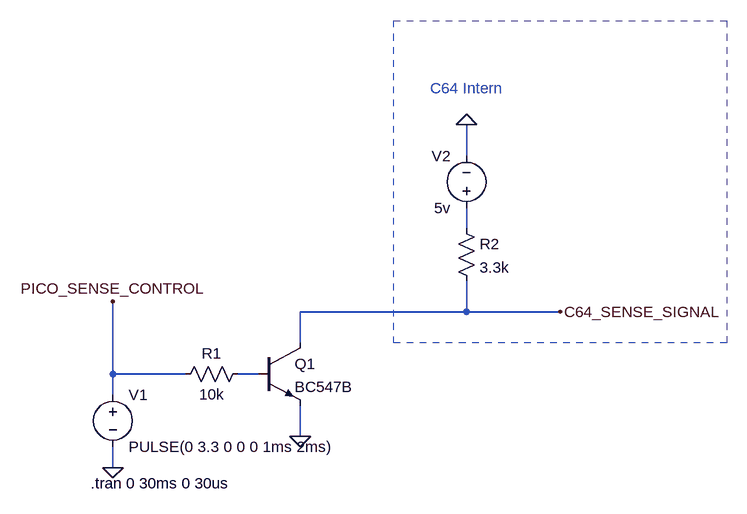
[diagram p0: schematic simulation_sense_signal_control.asc]
simulation_sense_signal_control.asc, the LTspice schematic file:
Version 4
SHEET 1 916 680
WIRE 512 -144 512 -192
WIRE 512 -32 512 -64
WIRE 512 96 512 48
WIRE 512 96 256 96
WIRE 656 96 512 96
WIRE 256 144 256 96
WIRE -32 192 -32 80
WIRE 80 192 -32 192
WIRE 192 192 160 192
WIRE -32 224 -32 192
WIRE 256 288 256 240
WIRE -32 336 -32 304
FLAG -32 336 0
FLAG 256 288 0
FLAG 512 -192 0
FLAG -32 80 PICO_SENSE_CONTROL
FLAG 656 96 C64_SENSE_SIGNAL
SYMBOL npn 192 144 R0
SYMATTR InstName Q1
SYMATTR Value BC547B
SYMBOL res 176 176 R90
WINDOW 0 0 56 VBottom 2
WINDOW 3 32 56 VTop 2
SYMATTR InstName R1
SYMATTR Value 10k
SYMBOL voltage -32 208 R0
WINDOW 123 0 0 Left 0
WINDOW 39 0 0 Left 0
SYMATTR InstName V1
SYMATTR Value PULSE(0 3.3 0 0 0 1ms 2ms)
SYMBOL res 496 -48 R0
SYMATTR InstName R2
SYMATTR Value 3.3k
SYMBOL voltage 512 -48 R180
WINDOW 0 24 96 Left 2
WINDOW 3 24 16 Left 2
WINDOW 123 0 0 Left 0
WINDOW 39 0 0 Left 0
SYMATTR InstName V2
SYMATTR Value 5v
TEXT -66 360 Left 2 !.tran 0 30ms 0 30us
TEXT 456 -248 Left 2 ;C64 Intern
RECTANGLE Normal 912 144 400 -352 2

The netlist it stands for:
* simulation_sense_signal_control.asc
Q1 C64_SENSE_SIGNAL N002 0 0 BC547B
R1 N002 PICO_SENSE_CONTROL 10k
V1 PICO_SENSE_CONTROL 0 PULSE(0 3.3 0 0 0 1ms 2ms)
R2 N001 C64_SENSE_SIGNAL 3.3k
V2 N001 0 5v
.model NPN NPN
.model PNP PNP
.lib standard.bjt
.tran 0 30ms 0 30us
* C64 Intern
.backanno
.end

* Results of the author's LTspice run, read from the files saved beside the schematic
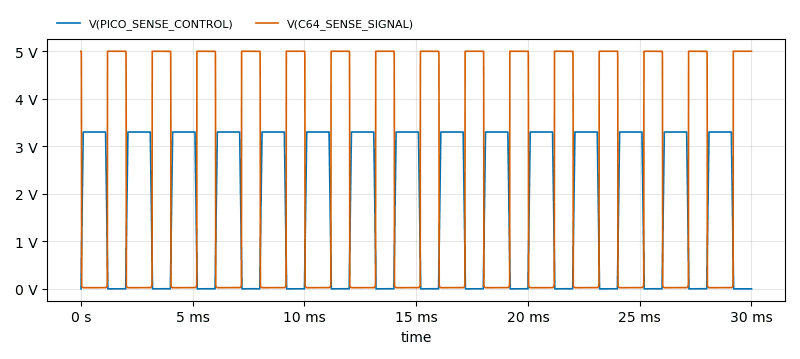
[diagram p1: Transient Analysis of simulation_sense_signal_control.asc, plotted from the saved traces]
* Transient Analysis, 1 run:
*   V(PICO_SENSE_CONTROL): min 0 V, max 3.3 V, average 1.815 V, rms 2.411 V, last 0 V
*   V(C64_SENSE_SIGNAL): min 24.23 mV, max 5 V, average 2.113 V, rms 3.235 V, last 5 V